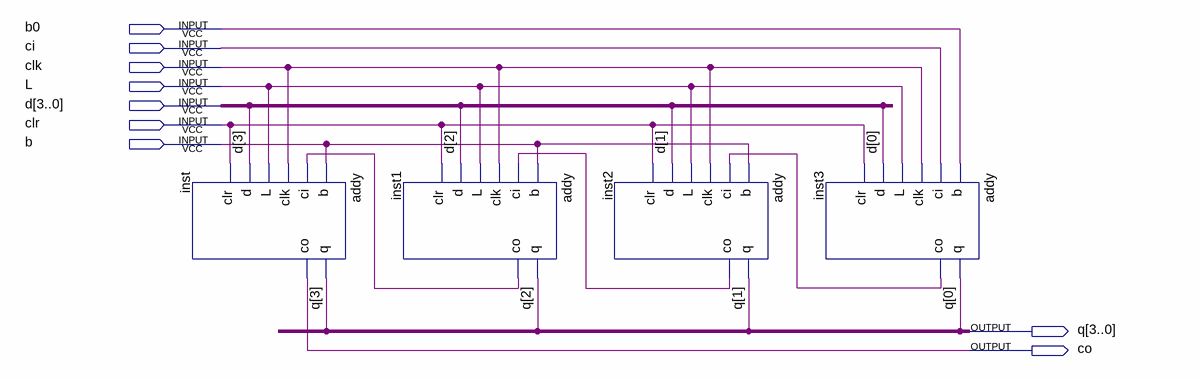
[diagram p0: schematic sheet]
// Quartus schematic addr0.bdf as structural Verilog: 4 symbols, 9 pins
module addr0 (
  input  b0,
  input  ci,
  input  clk,
  input  L,
  input  [3:0] d,
  input  clr,
  input  b,
  output [3:0] q,
  output co
);

  wire inst1_co, inst2_co, inst3_co;

  addy inst (.b(b), .ci(inst1_co), .clk(clk), .L(L), .d(d[3]), .clr(clr), .q(q[3]), .co(co));
  addy inst1 (.b(b), .ci(inst2_co), .clk(clk), .L(L), .d(d[2]), .clr(clr), .q(q[2]), .co(inst1_co));
  addy inst2 (.b(b), .ci(inst3_co), .clk(clk), .L(L), .d(d[1]), .clr(clr), .q(q[1]), .co(inst2_co));
  addy inst3 (.b(b0), .ci(ci), .clk(clk), .L(L), .d(d[0]), .clr(clr), .q(q[0]), .co(inst3_co));
endmodule
